# Altium schematic sheet Perph_connectors.SchDoc
size A4; SheetNumber: 4; SheetTotal: 12
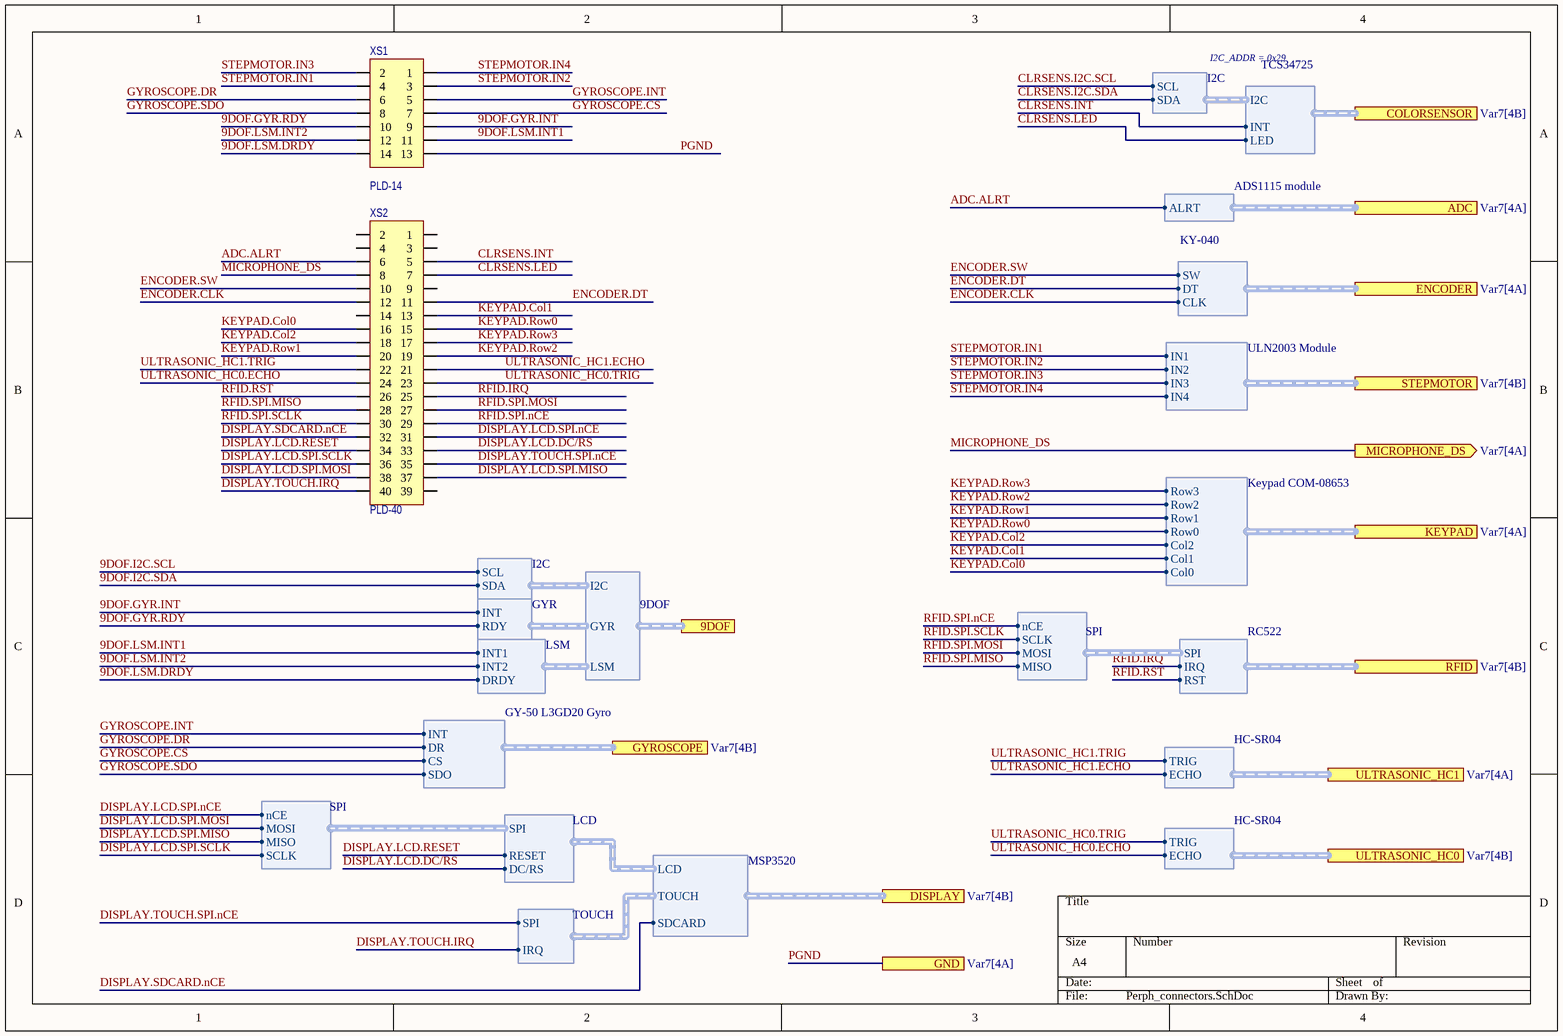
[diagram p0: Perph_connectors.SchDoc]

## Parts
XS1  PLD-14  [PBD-14]
XS2  PLD-40  [PLD-40]

## Ports
9DOF (harness 9DOF), ADC (harness ADS1115 module, see Var7[4A]), COLORSENSOR (harness TCS34725, see Var7[4B]), DISPLAY (harness MSP3520, see Var7[4B]), ENCODER (harness KY-040, see Var7[4A]), GND (see Var7[4A]), GYROSCOPE (harness GY-50 L3GD20 Gyro, see Var7[4B]), KEYPAD (harness Keypad COM-08653, see Var7[4A]), MICROPHONE_DS (out, see Var7[4A]), RFID (harness RC522, see Var7[4B]), STEPMOTOR (harness ULN2003 Module, see Var7[4B]), ULTRASONIC_HC0 (harness HC-SR04, see Var7[4B]), ULTRASONIC_HC1 (harness HC-SR04, see Var7[4A])

## Harnesses
ADS1115 module: ALRT
ULN2003 Module: IN1, IN2, IN3, IN4
RC522: IRQ, RST, SPI
SPI: nCE, MISO, MOSI, SCLK
Keypad COM-08653: Col0, Col1, Col2, Row0, Row1, Row2, Row3
GY-50 L3GD20 Gyro: SDO, CS, DR, INT
HC-SR04: ECHO, TRIG
LCD: SPI, RESET, DC/RS
TOUCH: SPI, IRQ
MSP3520: LCD, TOUCH, SDCARD
I2C: SCL, SDA
9DOF: I2C, GYR, LSM
GYR: INT, RDY
LSM: INT1, DRDY, INT2
TCS34725: I2C, INT, LED
KY-040: CLK, SW, DT

## Nets
9DOF.GYR.INT: XS1.9 ; harness GYR.INT
9DOF.GYR.RDY: XS1.10 ; harness GYR.RDY
9DOF.I2C.SCL: harness I2C.SCL
9DOF.I2C.SDA: harness I2C.SDA
9DOF.LSM.DRDY: XS1.14 ; harness LSM.DRDY
9DOF.LSM.INT1: XS1.11 ; harness LSM.INT1
9DOF.LSM.INT2: XS1.12 ; harness LSM.INT2
ADC.ALRT: XS2.6 ; port ADC.ALRT
CLRSENS.I2C.SCL: harness I2C.SCL
CLRSENS.I2C.SDA: harness I2C.SDA
CLRSENS.INT: XS2.5 ; port COLORSENSOR.INT
CLRSENS.LED: XS2.7
DISPLAY.LCD.DC/RS: XS2.33 ; harness LCD.DC/RS
DISPLAY.LCD.RESET: XS2.34 ; harness LCD.RESET
DISPLAY.LCD.SPI.MISO: XS2.37 ; harness SPI.MISO
DISPLAY.LCD.SPI.MOSI: XS2.38 ; harness SPI.MOSI
DISPLAY.LCD.SPI.nCE: XS2.31 ; harness SPI.nCE
DISPLAY.LCD.SPI.SCLK: XS2.36 ; harness SPI.SCLK
DISPLAY.SDCARD.nCE: XS2.32
DISPLAY.TOUCH.IRQ: XS2.40 ; harness TOUCH.IRQ
DISPLAY.TOUCH.SPI.nCE: XS2.35
ENCODER.CLK: XS2.12 ; port ENCODER.CLK
ENCODER.DT: XS2.11 ; port ENCODER.DT
ENCODER.SW: XS2.10 ; port ENCODER.SW
GYROSCOPE.CS: XS1.7 ; port GYROSCOPE.CS
GYROSCOPE.DR: XS1.6 ; port GYROSCOPE.DR
GYROSCOPE.INT: XS1.5 ; port GYROSCOPE.INT
GYROSCOPE.SDO: XS1.8 ; port GYROSCOPE.SDO
KEYPAD.Col0: XS2.16 ; port KEYPAD.Col0
KEYPAD.Col1: XS2.13 ; port KEYPAD.Col1
KEYPAD.Col2: XS2.18 ; port KEYPAD.Col2
KEYPAD.Row0: XS2.15 ; port KEYPAD.Row0
KEYPAD.Row1: XS2.20 ; port KEYPAD.Row1
KEYPAD.Row2: XS2.19 ; port KEYPAD.Row2
KEYPAD.Row3: XS2.17 ; port KEYPAD.Row3
MICROPHONE_DS: XS2.8 ; port MICROPHONE_DS
PGND: XS1.13 ; port GND
RFID.IRQ: XS2.25 ; port RFID.IRQ
RFID.RST: XS2.26 ; port RFID.RST
RFID.SPI.MISO: XS2.28 ; harness SPI.MISO
RFID.SPI.MOSI: XS2.27 ; harness SPI.MOSI
RFID.SPI.nCE: XS2.29 ; harness SPI.nCE
RFID.SPI.SCLK: XS2.30 ; harness SPI.SCLK
STEPMOTOR.IN1: XS1.4 ; port STEPMOTOR.IN1
STEPMOTOR.IN2: XS1.3 ; port STEPMOTOR.IN2
STEPMOTOR.IN3: XS1.2 ; port STEPMOTOR.IN3
STEPMOTOR.IN4: XS1.1 ; port STEPMOTOR.IN4
ULTRASONIC_HC0.ECHO: XS2.24 ; port ULTRASONIC_HC0.ECHO
ULTRASONIC_HC0.TRIG: XS2.23 ; port ULTRASONIC_HC0.TRIG
ULTRASONIC_HC1.ECHO: XS2.21 ; port ULTRASONIC_HC1.ECHO
ULTRASONIC_HC1.TRIG: XS2.22 ; port ULTRASONIC_HC1.TRIG

Not connected (* = marked no-connect by the designer): XS2 1 2 3 4 9 14 39

## Notes on the sheet
- I2C_ADDR = 0x29